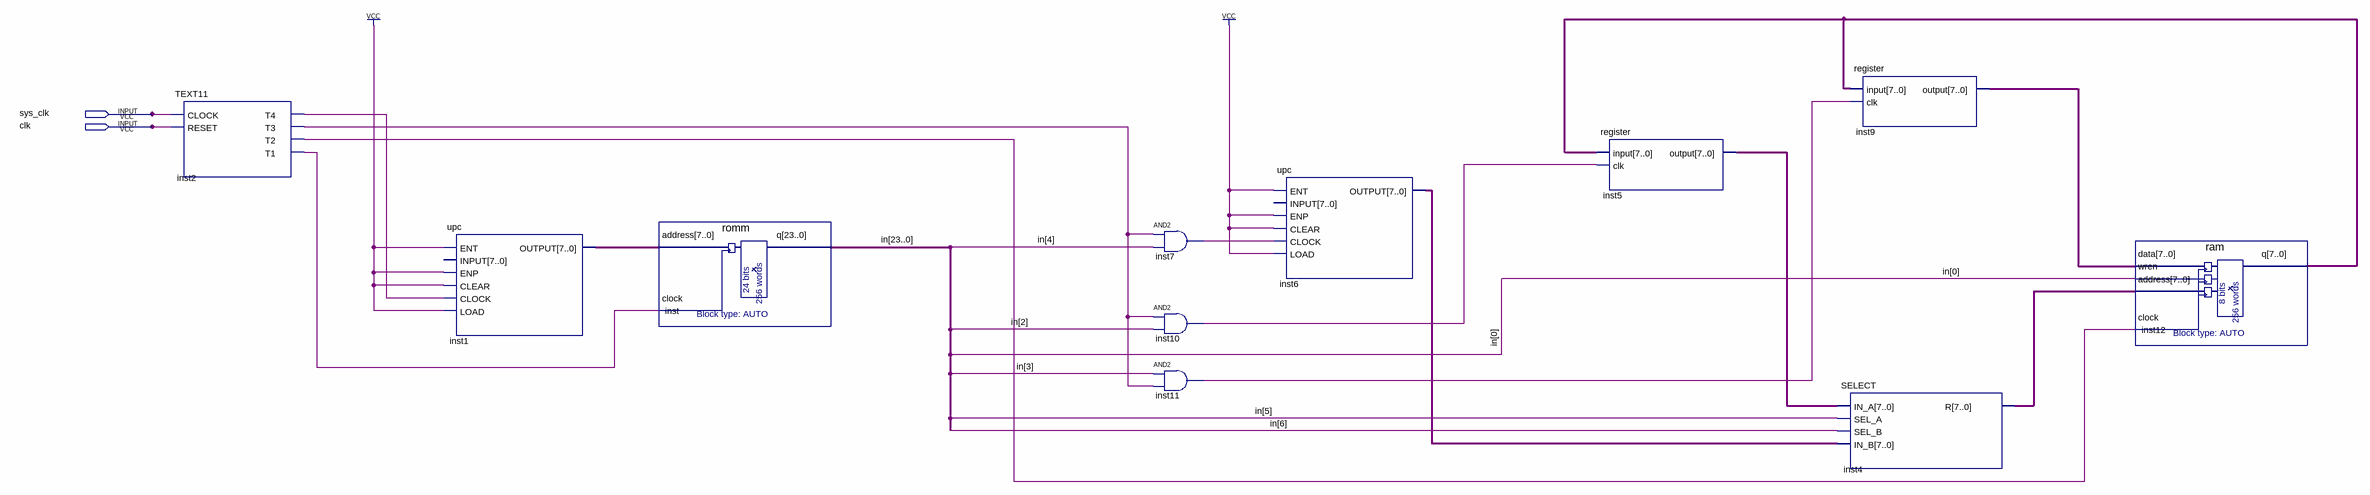
[diagram p0: schematic sheet]
// Quartus schematic EX2.bdf as structural Verilog: 11 symbols, 2 pins
module EX2 (
  input  sys_clk,
  input  clk
);

  wire inst2_t1, inst2_t2, inst2_t3, inst2_t4, inst7_out, inst10_out, inst11_out;
  wire [7:0] inst1_output, inst4_r, inst5_output, inst6_output, inst9_output, inst12_q;
  wire [23:0] in;

  TEXT11 inst2 (.CLOCK(sys_clk), .RESET(clk), .T4(inst2_t4), .T3(inst2_t3), .T2(inst2_t2), .T1(inst2_t1));
  upc inst1 (
    .ENT(1'b1), .ENP(1'b1), .CLEAR(1'b1), .CLOCK(inst2_t4), .LOAD(1'b1), .OUTPUT(inst1_output));  // open: INPUT
  romm inst (.address(inst1_output), .clock(inst2_t1), .q(in));
  and inst7 (inst7_out, inst2_t3, in[4]);
  and inst10 (inst10_out, inst2_t3, in[2]);
  and inst11 (inst11_out, in[3], inst2_t3);
  upc inst6 (
    .ENT(1'b1), .ENP(1'b1), .CLEAR(1'b1), .CLOCK(inst7_out), .LOAD(1'b1), .OUTPUT(inst6_output));  // open: INPUT
  register inst5 (.\input (inst12_q), .clk(inst10_out), .\output (inst5_output));
  SELECT inst4 (.IN_A(inst5_output), .SEL_A(in[5]), .SEL_B(in[6]), .IN_B(inst6_output), .R(inst4_r));
  register inst9 (.\input (inst12_q), .clk(inst11_out), .\output (inst9_output));
  ram inst12 (.data(inst9_output), .wren(in[0]), .address(inst4_r), .clock(inst2_t2), .q(inst12_q));
endmodule
